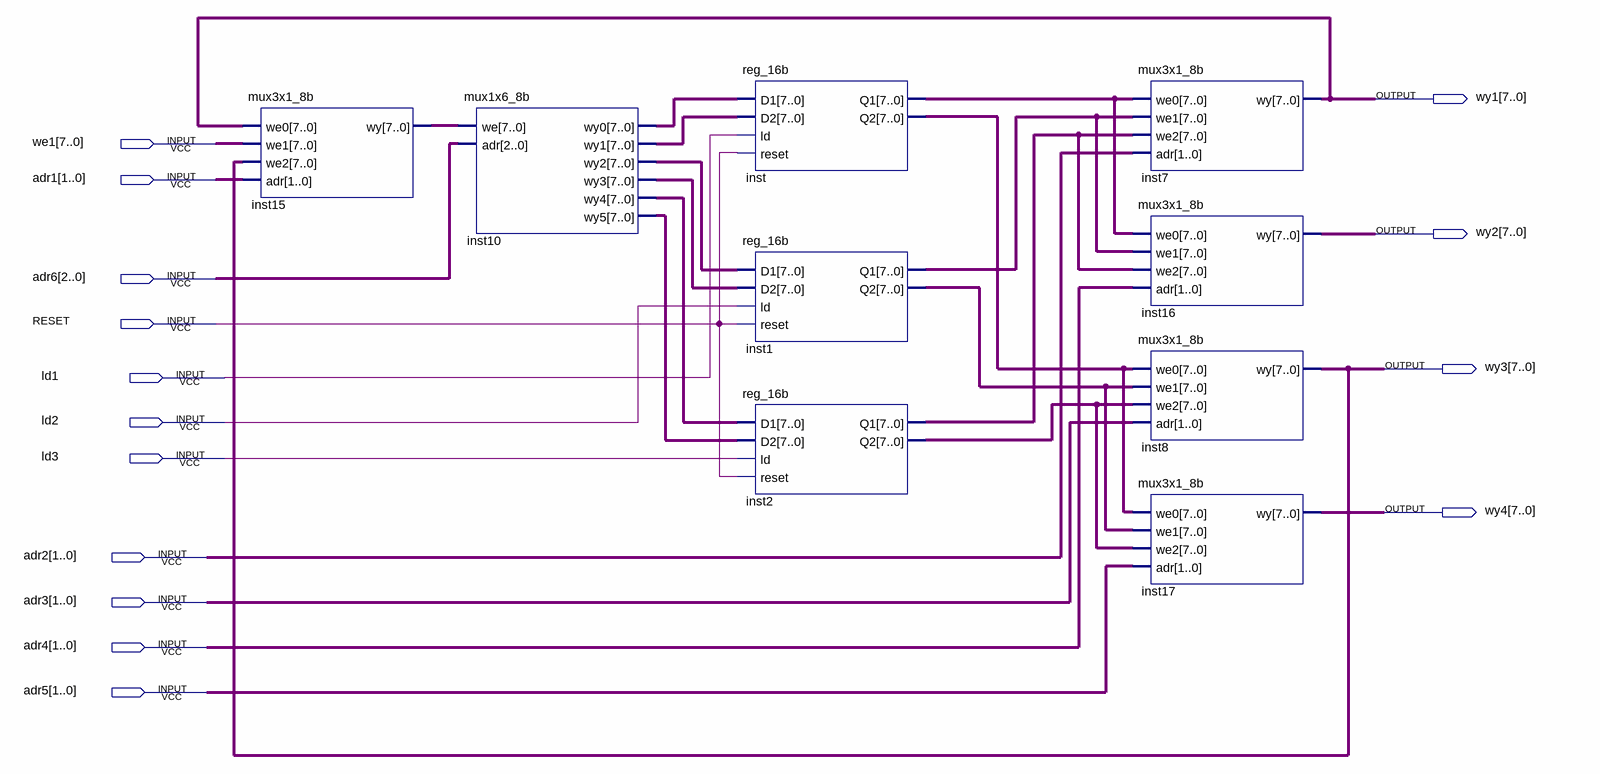
[diagram p0: schematic sheet]
// Quartus schematic Bank.bdf as structural Verilog: 9 symbols, 15 pins
module Bank (
  input  [7:0] we1,
  input  [1:0] adr1,
  input  [2:0] adr6,
  input  RESET,
  input  ld1,
  input  ld2,
  input  ld3,
  input  [1:0] adr2,
  input  [1:0] adr3,
  input  [1:0] adr4,
  input  [1:0] adr5,
  output [7:0] wy1,
  output [7:0] wy2,
  output [7:0] wy3,
  output [7:0] wy4
);

  wire [7:0] inst1_q1, inst1_q2, inst2_q1, inst2_q2, inst10_wy0, inst10_wy1, inst10_wy2, inst10_wy3,
       inst10_wy4, inst10_wy5, inst15_wy, inst_q1, inst_q2;

  mux3x1_8b inst15 (.we0(wy1), .we1(we1), .we2(wy3), .adr(adr1), .wy(inst15_wy));
  mux1x6_8b inst10 (
    .we(inst15_wy), .adr(adr6), .wy0(inst10_wy0), .wy1(inst10_wy1), .wy2(inst10_wy2), .wy3(inst10_wy3),
    .wy4(inst10_wy4), .wy5(inst10_wy5));
  reg_16b inst (.D1(inst10_wy0), .D2(inst10_wy1), .ld(ld1), .reset(RESET), .Q1(inst_q1), .Q2(inst_q2));
  reg_16b inst1 (.D1(inst10_wy2), .D2(inst10_wy3), .ld(ld2), .reset(RESET), .Q1(inst1_q1), .Q2(inst1_q2));
  reg_16b inst2 (.D1(inst10_wy4), .D2(inst10_wy5), .ld(ld3), .reset(RESET), .Q1(inst2_q1), .Q2(inst2_q2));
  mux3x1_8b inst7 (.we0(inst_q1), .we1(inst1_q1), .we2(inst2_q1), .adr(adr2), .wy(wy1));
  mux3x1_8b inst16 (.we0(inst_q1), .we1(inst1_q1), .we2(inst2_q1), .adr(adr4), .wy(wy2));
  mux3x1_8b inst8 (.we0(inst_q2), .we1(inst1_q2), .we2(inst2_q2), .adr(adr3), .wy(wy3));
  mux3x1_8b inst17 (.we0(inst_q2), .we1(inst1_q2), .we2(inst2_q2), .adr(adr5), .wy(wy4));
endmodule
